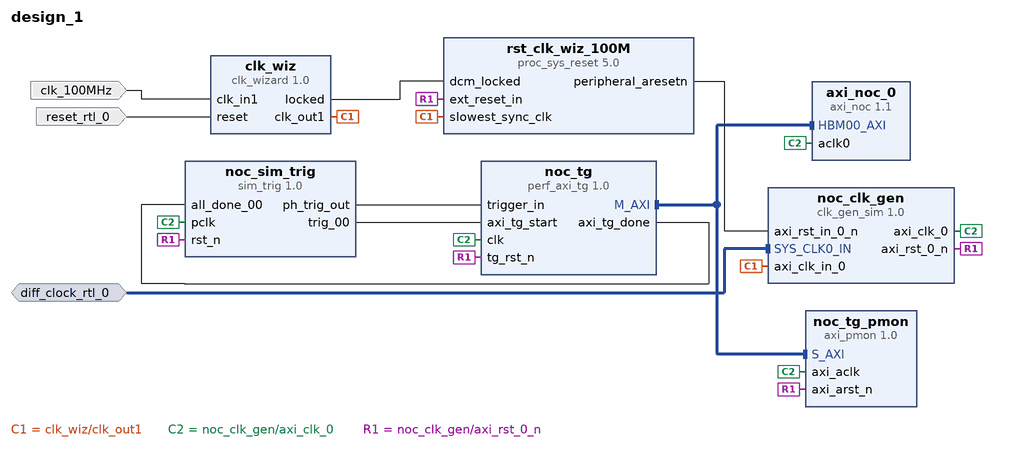
[diagram p0: block diagram of the top level]
# Vivado block design design_1, xcvh1582-vsva3697-2MP-e-S, Vivado 2024.2
create_bd_design design_1

create_bd_intf_port -mode Slave -vlnv xilinx.com:interface:diff_clock_rtl:1.0 diff_clock_rtl_0
set_property -dict {CONFIG.FREQ_HZ 100000000} [get_bd_intf_ports diff_clock_rtl_0]
create_bd_port -dir I -type clk clk_100MHz
set_property -dict {CONFIG.FREQ_HZ 100000000} [get_bd_ports clk_100MHz]
create_bd_port -dir I -type rst reset_rtl_0
set_property -dict {CONFIG.POLARITY ACTIVE_HIGH} [get_bd_ports reset_rtl_0]

create_bd_cell -type ip -vlnv xilinx.com:ip:axi_noc:1.1 axi_noc_0
set_property -dict [list \
  CONFIG.HBM_NUM_CHNL 1 \
  CONFIG.HBM_REF_CLK_SELECTION Internal \
  CONFIG.NUM_CLKS 1 \
  CONFIG.NUM_HBM_BLI 1 \
  CONFIG.NUM_MI 0 \
  CONFIG.NUM_SI 0 \
] [get_bd_cells axi_noc_0]
create_bd_cell -type ip -vlnv xilinx.com:ip:clk_gen_sim:1.0 noc_clk_gen
set_property -dict [list \
  CONFIG.USER_AXI_CLK_0_FREQ 400.000 \
  CONFIG.USER_NUM_OF_SYS_CLK 1 \
  CONFIG.USER_SYS_CLK0_FREQ 100.000 \
] [get_bd_cells noc_clk_gen]
create_bd_cell -type ip -vlnv xilinx.com:ip:perf_axi_tg:1.0 noc_tg
set_property -dict [list \
  CONFIG.DG_SCR_SEV false \
  CONFIG.IS_CONN_SLAVE_AXI_NOC true \
  CONFIG.USER_C_AXI_CLK_PERIOD 2500 \
  CONFIG.USER_C_AXI_READ_BANDWIDTH 12800 \
  CONFIG.USER_C_AXI_READ_BASEADDR 0x0000004000000000 \
  CONFIG.USER_C_AXI_READ_HIGHADDR 0x000000403FFFFFFF \
  CONFIG.USER_C_AXI_READ_LEN 127 \
  CONFIG.USER_C_AXI_READ_SIZE 32 \
  CONFIG.USER_C_AXI_SLAVE_DATA_WIDTH 128 \
  CONFIG.USER_C_AXI_TEST_SELECT writes_followed_by_reads \
  CONFIG.USER_C_AXI_WDATA_WIDTH 256 \
  CONFIG.USER_C_AXI_WID_WIDTH 7 \
  CONFIG.USER_C_AXI_WRITE_BANDWIDTH 12800 \
  CONFIG.USER_C_AXI_WRITE_BASEADDR 0x0000004000000000 \
  CONFIG.USER_C_AXI_WRITE_BASEADDR_SLV 0x0000004000000000 \
  CONFIG.USER_C_AXI_WRITE_HIGHADDR 0x000000403FFFFFFF \
  CONFIG.USER_C_AXI_WRITE_HIGHADDR_SLV 0x000000403FFFFFFF \
  CONFIG.USER_C_AXI_WRITE_LEN 127 \
  CONFIG.USER_C_AXI_WRITE_SIZE 32 \
  CONFIG.USER_NO_OF_SLAVE_CONNECTED 1 \
] [get_bd_cells noc_tg]
create_bd_cell -type ip -vlnv xilinx.com:ip:sim_trig:1.0 noc_sim_trig
create_bd_cell -type ip -vlnv xilinx.com:ip:axi_pmon:1.0 noc_tg_pmon
set_property -dict {CONFIG.USER_PARAM_AXI_TG_ID 0} [get_bd_cells noc_tg_pmon]
create_bd_cell -type ip -vlnv xilinx.com:ip:clk_wizard:1.0 clk_wiz
set_property -dict [list \
  CONFIG.CLKOUT_REQUESTED_OUT_FREQUENCY 100.0 \
  CONFIG.USE_LOCKED true \
  CONFIG.USE_RESET true \
] [get_bd_cells clk_wiz]
create_bd_cell -type ip -vlnv xilinx.com:ip:proc_sys_reset:5.0 rst_clk_wiz_100M

# ---- connections ----

connect_bd_intf_net -intf_net diff_clock_rtl_0_1 [get_bd_intf_ports diff_clock_rtl_0] [get_bd_intf_pins noc_clk_gen/SYS_CLK0_IN]
connect_bd_intf_net [get_bd_intf_pins noc_tg/M_AXI] [get_bd_intf_pins axi_noc_0/HBM00_AXI]
connect_bd_intf_net [get_bd_intf_pins noc_tg/M_AXI] [get_bd_intf_pins noc_tg_pmon/S_AXI]
connect_bd_net [get_bd_ports clk_100MHz] [get_bd_pins clk_wiz/clk_in1]
connect_bd_net [get_bd_pins clk_wiz/clk_out1] [get_bd_pins noc_clk_gen/axi_clk_in_0] [get_bd_pins rst_clk_wiz_100M/slowest_sync_clk]
connect_bd_net [get_bd_pins clk_wiz/locked] [get_bd_pins rst_clk_wiz_100M/dcm_locked]
connect_bd_net [get_bd_pins noc_clk_gen/axi_clk_0] \
  [get_bd_pins noc_sim_trig/pclk] [get_bd_pins noc_tg/clk] [get_bd_pins axi_noc_0/aclk0] [get_bd_pins noc_tg_pmon/axi_aclk]
connect_bd_net [get_bd_pins noc_clk_gen/axi_rst_0_n] \
  [get_bd_pins noc_sim_trig/rst_n] [get_bd_pins noc_tg/tg_rst_n] [get_bd_pins noc_tg_pmon/axi_arst_n] \
  [get_bd_pins rst_clk_wiz_100M/ext_reset_in]
connect_bd_net [get_bd_pins noc_sim_trig/ph_trig_out] [get_bd_pins noc_tg/trigger_in]
connect_bd_net [get_bd_pins noc_sim_trig/trig_00] [get_bd_pins noc_tg/axi_tg_start]
connect_bd_net [get_bd_pins noc_tg/axi_tg_done] [get_bd_pins noc_sim_trig/all_done_00]
connect_bd_net -net reset_rtl_0_1 [get_bd_ports reset_rtl_0] [get_bd_pins clk_wiz/reset]
connect_bd_net [get_bd_pins rst_clk_wiz_100M/peripheral_aresetn] [get_bd_pins noc_clk_gen/axi_rst_in_0_n]

# ---- address map ----
assign_bd_address -offset 0x0000004000000000 -range 1G -target_address_space [get_bd_addr_spaces noc_tg/Data] [get_bd_addr_segs axi_noc_0/HBM00_AXI/HBM0_PC0]

validate_bd_design
save_bd_design
